# Altium project egitim_proje.PrjPcb (part 1 of 3)
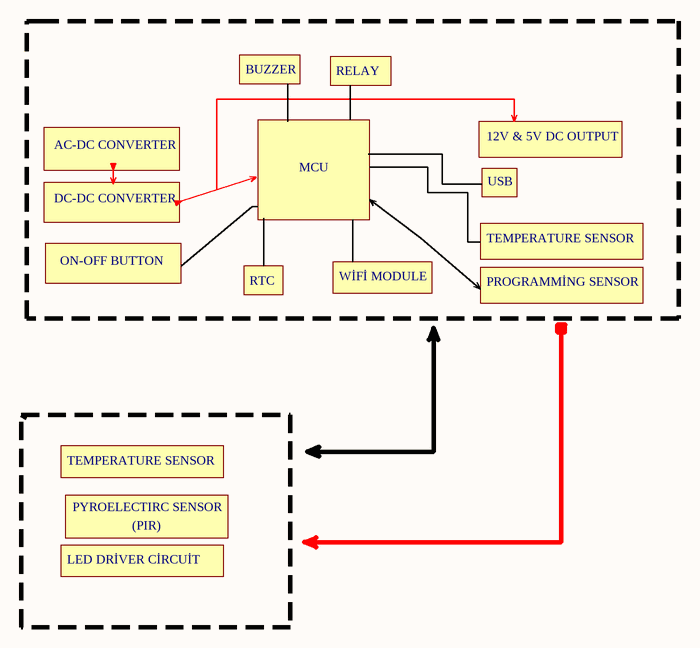
[diagram p0: Block_Diagram.SchDoc]
4 sheets, 127 parts. Net scope: flat (ports and power ports of the same name join across sheets).
Board file: PCB1.PcbDoc
Sheets:
  Block_Diagram.SchDoc
  Power Menegament.SchDoc
  Microocontroller.SchDoc
  Sensor_Board.SchDoc

## Sheet Block_Diagram.SchDoc
size A3; Date: 24.01.2025; DocumentNumber: 2; Revision: a; SheetNumber: 2; SheetTotal: 5; project name: wirelless security dedector; ENG_APP_DATE: --/--/--; DSN_APP_DATE: --/--/--; CHK_APP_DATE: --/--/--

### Notes on the sheet
- BUZZER
- RELAY
- AC-DC CONVERTER
- MCU
- 12V & 5V DC OUTPUT
- USB
- DC-DC CONVERTER
- ON-OFF BUTTON
- TEMPERATURE SENSOR
- RTC
- WİFİ MODULE
- PROGRAMMİNG SENSOR
- PYROELECTIRC SENSOR
- (PIR)
- LED DRİVER CİRCUİT
- DWG. NO.
- REV.
- SHT.
- REVISION
- DESCRIPTION
- DATE
- APPROVED
- THIS DOCUMENT AND THE DATA DISCLOSED HEREIN OR HEREWITH IS THE PROPERTY OF ALTIUM LIMITED AND MAY BE FREELY DISTRIBUTED IN WHOLE. NO RIGHTS ARE RESERVED OR EXPRESS OR IMPLIED WARANTEE GIVEN.
- ENG:
- DSN:
- APPROVALS
- PROJECT
- DOCUMENT REVISION:
- DESIGN ITEM:
- CHK:
- BOM:
- REFERENCE DOCUMENTS
- PROJECT REVISION:
- TITLE
- FAB DWG:
- PCB DWG:
- ASSY DWG:
- SCALE:
- SIZE
- C
- CAGE CODE
- FILE NAME
- DWG NO.
- SHEET
- OF
- REV

## Sheet Power Menegament.SchDoc
size A3; Date: 03.02.2025; CompanyName: Karadeniz Teknik Üniversitesi; Engineer: Kerem D.; SheetNumber: 4; SheetTotal: 6
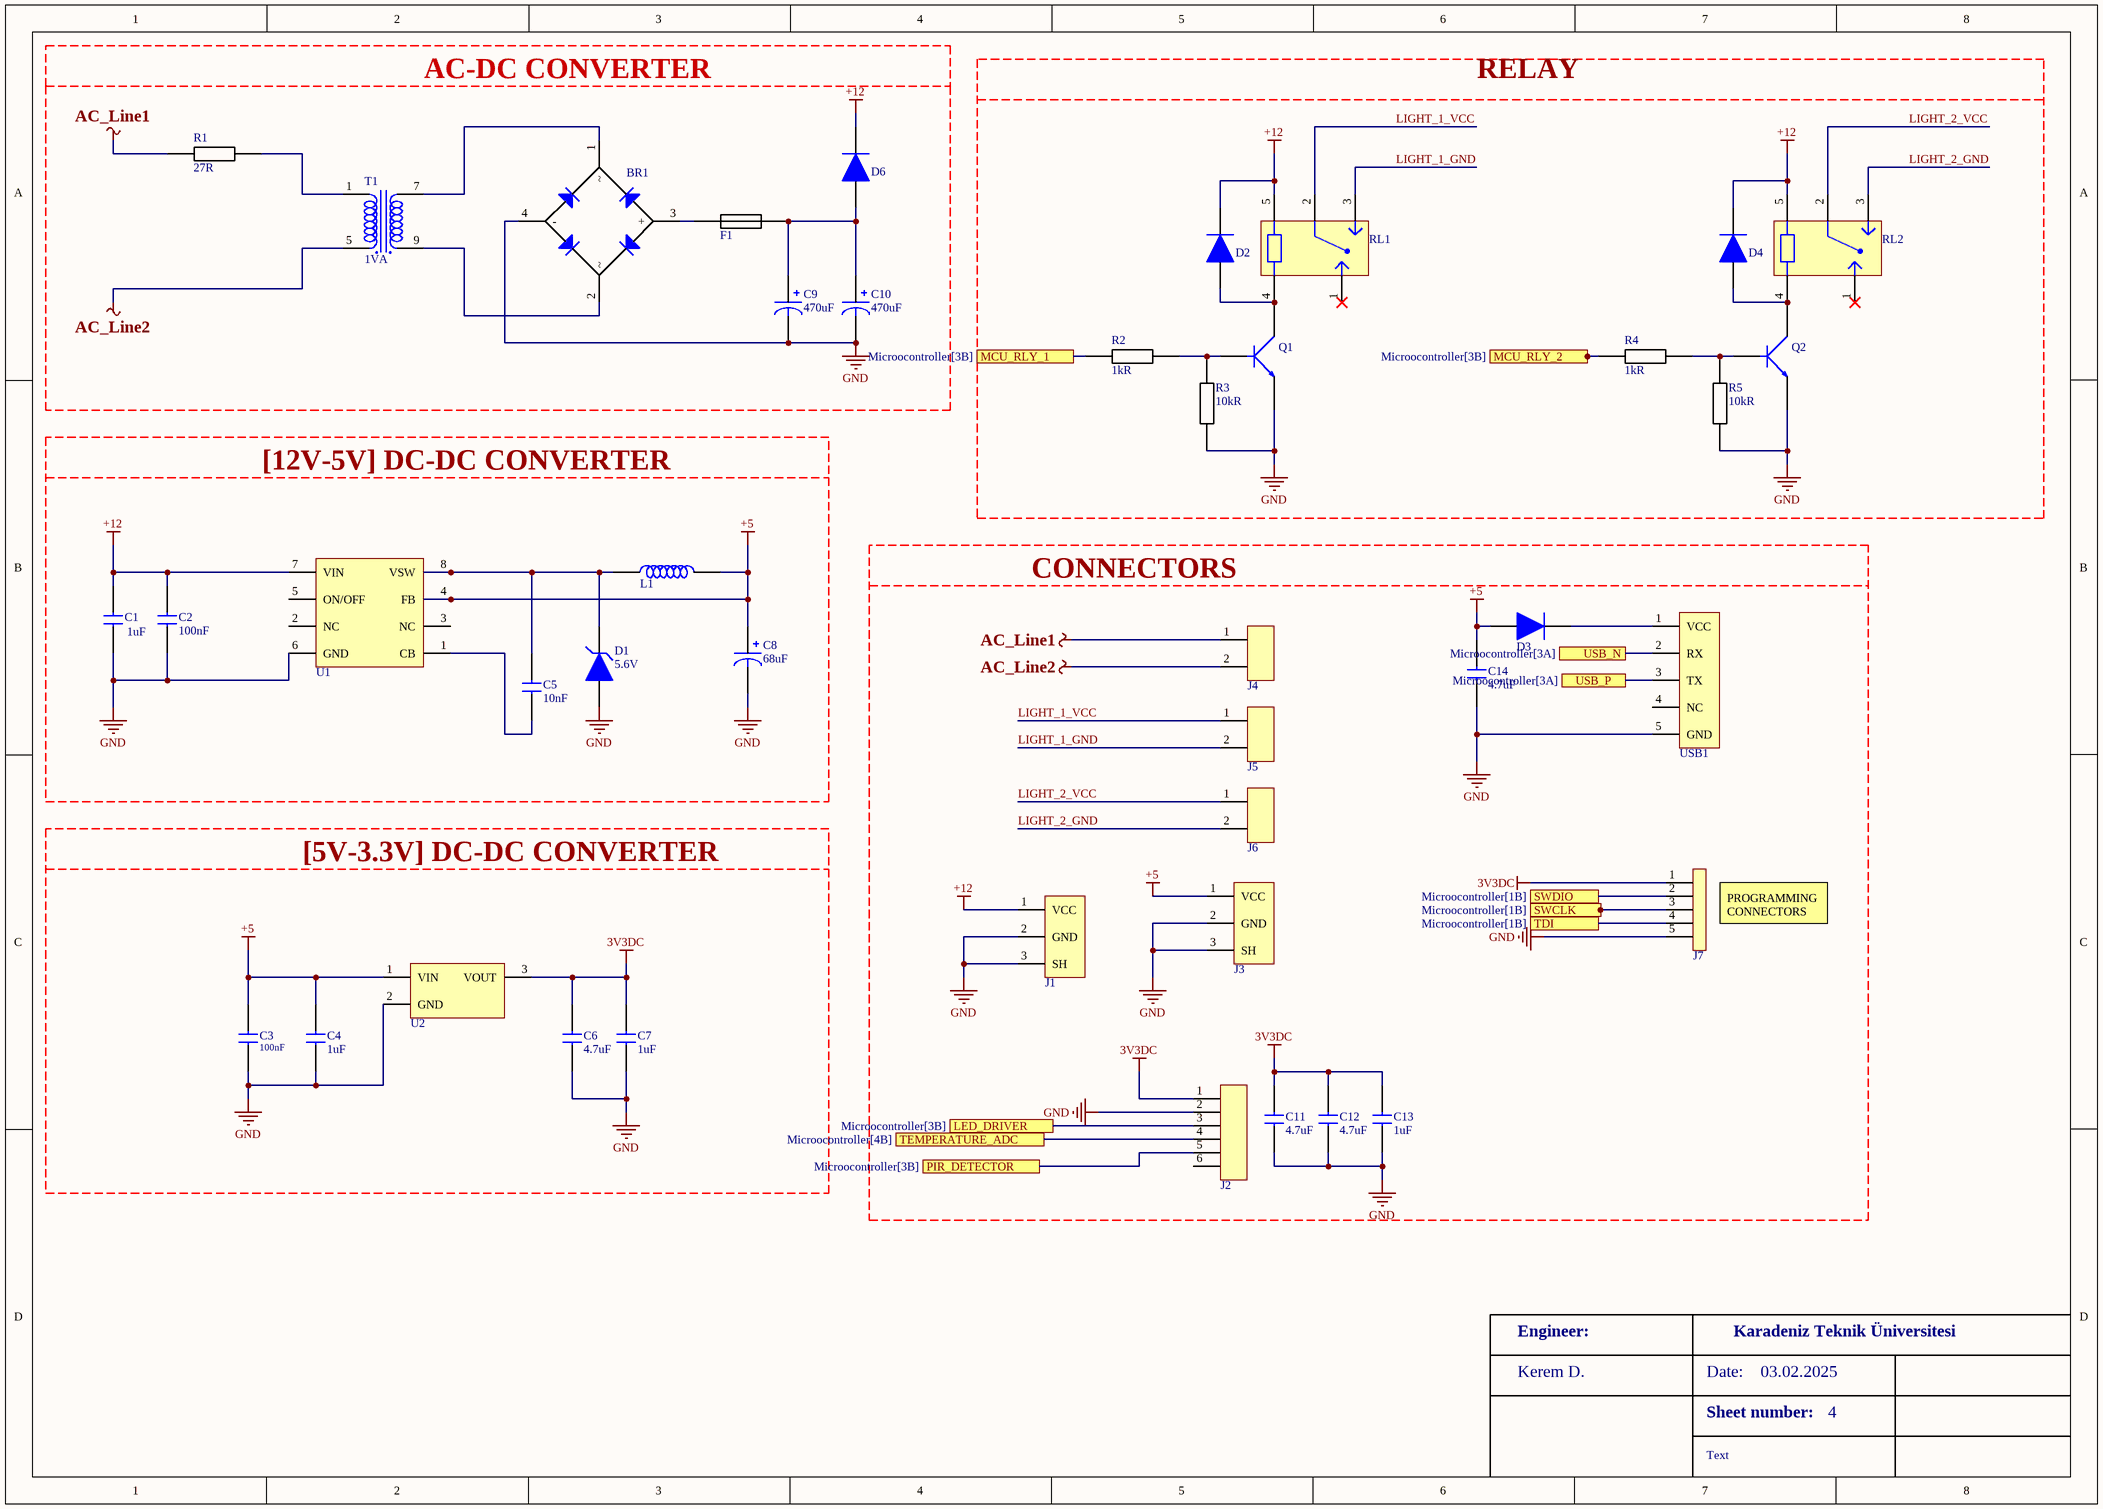
[diagram p1: Power Menegament.SchDoc]

### Parts
BR1  DB105STR  [DB105STR]  (value not drawn)
C1  value 1uF  [CAP_0805]  (hidden comment: CHA08C105K4RXL7189)
C2  value 100nF  [CAP_0805]  (hidden comment: CL21B104KBCNNNC)
C3  value 100nF  [CAP_0603]  (hidden comment: C0603C104M5RACTU)
C4  value 1uF  [CAP_0805]  (hidden comment: CHA08C105K4RXL7189)
C5  value 10nF  [CAP_0603]  (hidden comment: 0603B103K160CT)
C6  value 4.7uF  [CAP_0805]  (hidden comment: CL21A475KAQNNNE)
C7  value 1uF  [CAP_0805]  (hidden comment: CHA08C105K4RXL7189)
C8  value 68uF  [CAP EEVSERİES]  (hidden comment: EEV686M035A9HAA)
C9  value 470uF  [CAP_RADİAL_D10_R5]  (hidden comment: ESH477M035AH4AA)
C10  value 470uF  [CAP_RADİAL_D10_R5]  (hidden comment: ESH477M035AH4AA)
C11  value 4.7uF  [CAP_0805]  (hidden comment: CL21A475KAQNNNE)
C12  value 4.7uF  [CAP_0805]  (hidden comment: CL21A475KAQNNNE)
C13  value 1uF  [CAP_0805]  (hidden comment: CHA08C105K4RXL7189)
C14  value 4.7uF  [CAP_0805]  (hidden comment: CL21A475KAQNNNE)
D1  Reference Voltage-Nom: 5.6V  [SMB]  (hidden comment: 1SMB5919BT3G)
D2  1N4148WS  [SOD323F]  (value not drawn)
D3  1N4148WS  [SOD323F]  (value not drawn)
D4  1N4148WS  [SOD323F]  (value not drawn)
D6  1N4148WS  [SOD323F]  (value not drawn)
F1  3413.0216.22  [FUSE 3413.0216.22]  (value not drawn)
J1  JACK  [JACK]  (value not drawn)
J2  64800611622  [64800611622]  (value not drawn)
J3  JACK  [JACK]  (value not drawn)
J4  JACK  [TBP01R1-508]  (value not drawn)
J5  JACK  [TBP01R1-508]  (value not drawn)
J6  JACK  [TBP01R1-508]  (value not drawn)
J7  SMH-105-02-L-S  [PINHEADER1X5_RA]  (value not drawn)
L1  78438335470  [SMB]  (value not drawn)
Q1  MMBT3904-7-F  [SOT-23F]  (value not drawn)
Q2  MMBT3904-7-F  [SOT-23F]  (value not drawn)
R1  value 27R  [RES_AXIAL_W]  (hidden comment: 5WD27)
R2  value 1kR  [RES_0603]  (hidden comment: RC0603JR-071KL)
R3  value 10kR  [RES_0603]  (hidden comment: RC0603FR-0710KL)
R4  value 1kR  [RES_0603]  (hidden comment: RC0603JR-071KL)
R5  value 10kR  [RES_0603]  (hidden comment: RC0603FR-0710KL)
RL1  ALQ112  [ALQ112]  (value not drawn)
RL2  ALQ112  [ALQ112]  (value not drawn)
T1  Power - Max: 1VA  [BV302S12010-ZU]  (hidden comment: BV302S12010-ZU)
U1  LM2675MX-12/NOPB  [SOIC8]  (value not drawn)
U2  AP7361-33E-13  [SOT223]  (value not drawn)
USB1  10118192-0001LF  [Micro_B_USB]  (value not drawn)

### Blocks framed on the sheet
RELAY: D2 D4 Q1 Q2 R2-R5 RL1 RL2
AC-DC CONVERTER: BR1 C9 C10 D6 F1 R1 T1
[12V-5V] DC-DC CONVERTER: C1 C2 C5 C8 D1 L1 U1
CONNECTORS: C11-C14 D3 J1-J7 USB1
[5V-3.3V] DC-DC CONVERTER: C3 C4 C6 C7 U2

### Ports
LED_DRIVER (see Microocontroller[3B]), MCU_RLY_1 (see Microocontroller[3B]), MCU_RLY_2 (see Microocontroller[3B]), PIR_DETECTOR (see Microocontroller[3B]), SWCLK (see Microocontroller[1B]), SWDIO (see Microocontroller[1B]), TDI (see Microocontroller[1B]), TEMPERATURE_ADC (see Microocontroller[4B]), USB_N (see Microocontroller[3A]), USB_P (see Microocontroller[3A])

### Nets
3V3DC: C6.2 C7.2 C11.2 C12.2 C13.2 J2.1 J7.1 U2.3(VOUT)
+5: C3.2 C4.2 C8.1 C14.2 D3.2 J3.1(VCC) L1.2 U1.4(FB) U2.1(VIN)
+12: C1.2 C2.2 D2.1 D4.1 D6.1 J1.1(VCC) RL1.5 RL2.5 U1.7(VIN)
AC_Line1: J4.1 R1.1
AC_Line2: J4.2 T1.5
GND: BR1.4(-) C1.1 C2.1 C3.1 C4.1 C6.1 C7.1 C8.2 C9.2 C10.2 C11.1 C12.1 C13.1 C14.1 D1.1(A) J1.2(GND) J1.3(SH) J2.2 J3.2(GND) J3.3(SH) J7.5 Q1.2(E) Q2.2(E) R3.1 R5.1 U1.6(GND) U2.2(GND) USB1.5(GND)
LIGHT_1_GND: J5.2 RL1.3
LIGHT_1_VCC: J5.1 RL1.2
LIGHT_2_GND: J6.2 RL2.3
LIGHT_2_VCC: J6.1 RL2.2
USB_N: USB1.2(RX) ; port USB_N
USB_P: USB1.3(TX) ; port USB_P
NetBR1_1: BR1.1 T1.7
NetBR1_2: BR1.2 T1.9
NetBR1_3: BR1.3(+) F1.1
NetC5_1: C5.1 U1.1(CB)
NetC5_2: C5.2 D1.2(C) L1.1 U1.8(VSW)
NetC9_1: C9.1 C10.1 D6.2 F1.2
NetD2_2: D2.2 Q1.3(C) RL1.4
NetD3_1: D3.1 USB1.1(VCC)
NetD4_2: D4.2 Q2.3(C) RL2.4
NetJ2_3: J2.3 ; port LED_DRIVER
NetJ2_4: J2.4 ; port TEMPERATURE_ADC
NetJ2_5: J2.5 ; port PIR_DETECTOR
NetJ7_2: J7.2 ; port SWDIO
NetJ7_3: J7.3 ; port SWCLK
NetJ7_4: J7.4 ; port TDI
NetQ1_1: Q1.1(B) R2.2 R3.2
NetQ2_1: Q2.1(B) R4.2 R5.2
NetR1_2: R1.2 T1.1
NetR2_1: R2.1 ; port MCU_RLY_1
NetR4_1: R4.1 ; port MCU_RLY_2

Not connected (* = marked no-connect by the designer): J2 6; RL1 1(+)*; RL2 1(+)*; U1 2(NC) 3(NC) 5(ON/OFF); USB1 4(NC)

### Notes on the sheet
- (near J7) PROGRAMMING CONNECTORS
- Engineer:
- Date:
- Sheet number:
- Text

### Library data of the parts
BR1 = DB105STR: Bridge Rect 1PHASE 600V 1A Db-s; Manufacturer: Sangdest Microelectronics; Manufacturer Part Number: DB105S; Designed by: Kerem; Supplier: Digikey; Supplier Part Number: 1655-DB105SCT-ND; RoHS: No; Category: Uncategorized; Stock: 8973; Pricing: 1=0,44, 10=0,267, 100=0,1688, 500=0,12602 (USD); ComponentLink1Description: DATASHEET; ComponentLink1URL: https://www.smc-diodes.com/propdf/DB101S%20THRU%20DB107S%20N1459%20REV.B.pdf; Voltage - Peak Reverse (Max): 600V; Current: 1A
C1 C4 C7 C13 = CAP_CER_1uF_0805: Cap CER, 1uF, 16V, 0805;; Manufacturer: KEMET; Designed by: Kerem; Supplier: Digikey; Supplier Part Number: 399-CHA08C105K4RXL7189DKR-ND; Manufacturer Part Number: CHA08C105K4RXL7189; Stock: 600; Pricing: 1=8,82, 10=6,341, 100=4,9085 (USD); ComponentLink1URL: https://datasheet.octopart.com/CHA08C105K4RXL7189-KEMET-datasheet-181963755.pdf?src-supplier=Farnell; ComponentLink1Description: https://datasheet.octopart.com/CHA08C105K4RXL7189-KEMET-datasheet-181963755.pdf?src-supplier=Farnell
C2 = CAP_CER_100nF_0805: Ceramic Capacitor,50V, %10, 0.1uF, Surface Mount, 0805; Manufacturer: Samsung; Multilayer: Yes; Tolerance  (fill in as +-): 10%; Temperature Characteristics Code: X7R; Designed by: Kerem; Supplier: Digikey; Supplier Part Number: 1276-1003-1-ND; Manufacturer Part Number: CL21B104KBCNNNC; RoHS: Yes; Category: Ceramic Capacitors; Stock: 925106; Pricing: 1=0,1, 10=0,029, 100=0,0175, 1000=0,01156 (USD); Mounting Technology: Surface Mount; Pins: 2; Dielectric Material: Ceramic; Package Shape: Rectangular; Case/Package: 0805; Terminal Finish: Nickel; Min Operating Temperature: -55°C; Max Operating Temperature: 125°C; JESD-609 Code: e3; Capacitor Type: Ceramic; Package Style: SMTMeter; Packaging: Tape and Reel; Tolerance (fill in as +-): 10%; Rated DC Voltage (URdc): 50V; Termination: Wraparound; Length: 2mm; Width: 1.25mm; Height: 0.95mm; Reach SVHC Compliant: Yes; RoHS Compliant: Yes; ComponentLink1URL: https://datasheet.ciiva.com:443/pdfs/VipMasterIC/IC/SEMS/SEMS-S-A0008521003/SEMS-S-A0008521039-1.pdf?src-supplier=IHS+Markit; ComponentLink1Description: https://datasheet.ciiva.com:443/pdfs/VipMasterIC/IC/SEMS/SEMS-S-A0008521003/SEMS-S-A0008521039-1.pdf?src-supplier=IHS+Markit; ComponentLink2URL: https://datasheet.ciiva.com/25710/cl21b104kbcnnnc-25710182.pdf?src-supplier=Digikey; ComponentLink2Description: https://datasheet.ciiva.com/25710/cl21b104kbcnnnc-25710182.pdf?src-supplier=Digikey; ComponentLink3URL: https://datasheet.ciiva.com/29199/454152-da-01-en-vs-kondensator-0805-29199814.pdf?src-supplier=Conrad; ComponentLink3Description: https://datasheet.ciiva.com/29199/454152-da-01-en-vs-kondensator-0805-29199814.pdf?src-supplier=Conrad
C3 = CAP CER 100nF 0603: 0.1 µF ±20% 50V Ceramic Capacitor X7R 0603 (1608 Metric); Manufacturer: KEMET; Supplier: Digikey; Supplier Part Number: 399-C0603C104M5RACTUCT-ND; Manufacturer Part Number: C0603C104M5RACTU; RoHS: Yes; Category: Ceramic Capacitors; Stock: 3718959; Pricing: 1=0,1, 10=0,023, 100=0,0133, 1000=0,00866, 4000=0,00697, 8000=0,00632, 12000=0,00598, 20000=0,0056, 28000=0,00538, 40000=0,00516, 100000=0,00467, 200000=0,00436, 400000=0,0041 (USD); ComponentLink1URL: http://capacitoredge.kemet.com:80/capedge2/intellispec.jsp?pn=P2015898&displayPN=P2015898&src-supplier=IHS+Markit; ComponentLink1Description: http://capacitoredge.kemet.com:80/capedge2/intellispec.jsp?pn=P2015898&displayPN=P2015898&src-supplier=IHS+Markit; ComponentLink2URL: http://components.arrow.com/part/dataview/40911037S8853915N7429?src-supplier=Arrow+Electronics; ComponentLink2Description: http://components.arrow.com/part/dataview/40911037S8853915N7429?src-supplier=Arrow+Electronics; ComponentLink3URL: http://www.farnell.com/datasheets/2746056.pdf?src-supplier=Farnell; ComponentLink3Description: http://www.farnell.com/datasheets/2746056.pdf?src-supplier=Farnell; ComponentLink4URL: https://www.verical.com/server-webapp/html/getDatasheet?partID=626892&src-supplier=Verical; ComponentLink4Description: https://www.verical.com/server-webapp/html/getDatasheet?partID=626892&src-supplier=Verical; ComponentLink5URL: http://www.mouser.com/ds/2/212/KEM_C1002_X7R_SMD-1102033.pdf?src-supplier=Mouser; ComponentLink5Description: http://www.mouser.com/ds/2/212/KEM_C1002_X7R_SMD-1102033.pdf?src-supplier=Mouser; ComponentLink6URL: http://www.alliedelec.com/m/d/6f3b5eb83d09db50ed28bdc730567b33.pdf?src-supplier=Allied+Electronics; ComponentLink6Description: http://www.alliedelec.com/m/d/6f3b5eb83d09db50ed28bdc730567b33.pdf?src-supplier=Allied+Electronics; ComponentLink7URL: http://www.farnell.com/datasheets/1828800.pdf?src-supplier=Newark; ComponentLink7Description: http://www.farnell.com/datasheets/1828800.pdf?src-supplier=Newark; ComponentLink8URL: https://datasheet.octopart.com/C0603C104M5RACTU-Kemet-datasheet-5313890.pdf?src-supplier=Verical; ComponentLink8Description: https://datasheet.octopart.com/C0603C104M5RACTU-Kemet-datasheet-5313890.pdf?src-supplier=Verical; ComponentLink9URL: http://capacitoredge.kemet.com/capedge2/DataSheet?pn=C0603C104M5RAC7867&src-supplier=Avnet; ComponentLink9Description: http://capacitoredge.kemet.com/capedge2/DataSheet?pn=C0603C104M5RAC7867&src-supplier=Avnet; ComponentLink10URL: http://www.farnell.com/datasheets/2315113.pdf?src-supplier=Newark; ComponentLink10Description: http://www.farnell.com/datasheets/2315113.pdf?src-supplier=Newark; ComponentLink11URL: https://api.kemet.com/component-edge/download/datasheet/C0603C104M5RACTU.pdf?src-supplier=Digikey; ComponentLink11Description: https://api.kemet.com/component-edge/download/datasheet/C0603C104M5RACTU.pdf?src-supplier=Digikey; ComponentLink12URL: https://datasheet.octopart.com/C0603C104M5RACTU-Kemet-datasheet-65850025.pdf?src-supplier=Element14; ComponentLink12Description: https://datasheet.octopart.com/C0603C104M5RACTU-Kemet-datasheet-65850025.pdf?src-supplier=Element14; ComponentLink13URL: http://www.farnell.com/datasheets/2746056.pdf?src-supplier=Element14; ComponentLink13Description: http://www.farnell.com/datasheets/2746056.pdf?src-supplier=Element14; ComponentLink14URL: http://www.farnell.com/datasheets/2746056.pdf?src-supplier=Newark; ComponentLink14Description: http://www.farnell.com/datasheets/2746056.pdf?src-supplier=Newark; ComponentLink15URL: https://datasheet.octopart.com/C0603C104M5RACTU-KEMET-datasheet-157246124.pdf?src-supplier=Electro+Sonic; ComponentLink15Description: https://datasheet.octopart.com/C0603C104M5RACTU-KEMET-datasheet-157246124.pdf?src-supplier=Electro+Sonic; ComponentLink16URL: https://datasheet.octopart.com/C0603C104M5RACTU-KEMET-datasheet-68331906.pdf?src-supplier=TME; ComponentLink16Description: https://datasheet.octopart.com/C0603C104M5RACTU-KEMET-datasheet-68331906.pdf?src-supplier=TME
C5 = CAP_CER_10nF_0603: Ceramic Capacitor,16V, 10%, 0.01uF, Surface Mount, 0603; Manufacturer: Walsin Technologies; Designed by: Kerem; Multilayer: Yes; Temperature Characteristics Code: X7R; Supplier: Digikey; Supplier Part Number: 1292-1384-6-ND; Manufacturer Part Number: 0603B103K160CT; RoHS: Yes; Category: Ceramic Capacitors; Stock: 40006; Pricing: 1=0,1, 10=0,031, 50=0,018, 100=0,0139, 500=0,0105, 1000=0,00825 (USD); Mounting Technology: Surface Mount; Pins: 2; Dielectric Material: Ceramic; Case/Package: 0603; Package Shape: Rectangular; Terminal Finish: Nickel; Min Operating Temperature: -55°C; Max Operating Temperature: 125°C; Capacitor Type: Ceramic; Tolerance  (fill in as +-): 10%; Package Style: SMTMeter; Packaging: Tape and Reel; Tolerance (fill in as +-): 10%; Rated DC Voltage (URdc): 16V; JESD-609 Code: e3; Termination: Wraparound; Length: 1.6mm; Width: 0.8mm; Height: 0.8mm; Reach SVHC Compliant: Yes; RoHS Compliant: Yes; ComponentLink1URL: https://datasheet.ciiva.com:443/pdfs/VipMasterIC/IC/WATC/WATC-S-A0009550342/WATC-S-A0009550342-1.pdf?src-supplier=IHS+Markit; ComponentLink1Description: https://datasheet.ciiva.com:443/pdfs/VipMasterIC/IC/WATC/WATC-S-A0009550342/WATC-S-A0009550342-1.pdf?src-supplier=IHS+Markit; ComponentLink2URL: http://www.farnell.com/datasheets/1958513.pdf?src-supplier=Farnell; ComponentLink2Description: http://www.farnell.com/datasheets/1958513.pdf?src-supplier=Farnell; ComponentLink3URL: https://datasheet.octopart.com/0603B103K160CT-Walsin-Technologies-datasheet-85392065.pdf?src-supplier=Element14; ComponentLink3Description: https://datasheet.octopart.com/0603B103K160CT-Walsin-Technologies-datasheet-85392065.pdf?src-supplier=Element14; ComponentLink4URL: http://www.passivecomponent.com/wp-content/uploads/2018/10/MLCC.pdf?src-supplier=Digikey; ComponentLink4Description: http://www.passivecomponent.com/wp-content/uploads/2018/10/MLCC.pdf?src-supplier=Digikey; ComponentLink5URL: https://datasheet.octopart.com/0603B103K160CT-Walsin-Technologies-datasheet-136037192.pdf?src-supplier=Future+Electronics; ComponentLink5Description: https://datasheet.octopart.com/0603B103K160CT-Walsin-Technologies-datasheet-136037192.pdf?src-supplier=Future+Electronics; ComponentLink6URL: https://datasheet.octopart.com/0603B103K160CT-Walsin-Technologies-datasheet-62066062.pdf?src-supplier=TME; ComponentLink6Description: https://datasheet.octopart.com/0603B103K160CT-Walsin-Technologies-datasheet-62066062.pdf?src-supplier=TME
C6 C11 C12 C14 = CAP_CER_4.7uF_0805: CAP CER 4.7uF,%10, Surface Mount, 0805; Manufacturer: Samsung; Designed by: Kerem; Dielectric Material: Ceramic; Multilayer: Yes; Tolerance  (fill in as +-): 10%; Rated DC Voltage (URdc): 25V; Temperature Characteristics Code: X5R; Supplier: Digikey; Supplier Part Number: 1276-1244-1-ND; Manufacturer Part Number: CL21A475KAQNNNE; RoHS: Yes; Category: Ceramic Capacitors; Stock: 2727040; Pricing: 1=0,1, 10=0,048, 100=0,03, 1000=0,02035 (USD); Mounting Technology: Surface Mount; Pins: 2; Package Shape: Rectangular; Case/Package: 0805; Terminal Finish: Nickel; Min Operating Temperature: -55°C; Max Operating Temperature: 85°C; JESD-609 Code: e3; Capacitor Type: Ceramic; Package Style: SMTMeter; Packaging: Tape and Reel; Tolerance (fill in as +-): 10%; Termination: Wraparound; Length: 2mm; Width: 1.25mm; Height: 1.4mm; Reach SVHC Compliant: Yes; RoHS Compliant: Yes; ComponentLink1URL: https://datasheet.ciiva.com:443/pdfs/VipMasterIC/IC/SEMS/SEMS-S-A0008528919/SEMS-S-A0008528938-1.pdf?src-supplier=IHS+Markit; ComponentLink1Description: https://datasheet.ciiva.com:443/pdfs/VipMasterIC/IC/SEMS/SEMS-S-A0008528919/SEMS-S-A0008528938-1.pdf?src-supplier=IHS+Markit; ComponentLink2URL: https://datasheet.ciiva.com/25798/cl21a475kaqnnne-25798882.pdf?src-supplier=Digikey; ComponentLink2Description: https://datasheet.ciiva.com/25798/cl21a475kaqnnne-25798882.pdf?src-supplier=Digikey
C8 = CAP_ALU_68uF: Aluminum Electrolytic Capacitor, 35V, 20%, 68uF, Surface Mount, 2626; Manufacturer: KEMET; Designed by: Kerem; Dielectric Material: Aluminium; Polarity: Polarized; ESR (Equivalent Series Resistance): 340mR; Leakage Current: 23.8uA; Ripple Current: 196mA; Tan Delta: 0.12; Supplier: Digikey; Supplier Part Number: 399-6722-6-ND; Manufacturer Part Number: EEV686M035A9HAA; RoHS: Yes; Category: Aluminum Electrolytic Capacitors; Stock: 22607; Pricing: 1=0,57, 10=0,357, 50=0,2728, 100=0,2457, 500=0,19804 (USD); Mounting Technology: Surface Mount; Pins: 2; Package Shape: Cylindrical; Case/Package: 2626; Min Operating Temperature: -55°C; Max Operating Temperature: 105°C; Capacitor Type: Aluminium; Tolerance  (fill in as +-): 20%; Package Style: SMTMeter; Packaging: Tape and Reel; Tolerance (fill in as +-): 20%; Rated DC Voltage (URdc): 35V; Termination: Flat; Length: 7.8mm; Width: 6.6mm; Height: 7.7mm; Reach SVHC Compliant: Yes; RoHS Compliant: Yes; ComponentLink1URL: https://datasheet.ciiva.com:443/pdfs/VipMasterIC/IC/KEME/KEME-S-A0008611149/KEME-S-A0008611149-1.pdf?src-supplier=IHS+Markit; ComponentLink1Description: https://datasheet.ciiva.com:443/pdfs/VipMasterIC/IC/KEME/KEME-S-A0008611149/KEME-S-A0008611149-1.pdf?src-supplier=IHS+Markit; ComponentLink2URL: https://datasheet.ciiva.com/5365/kem-a4002-eev-535332-5365784.pdf?src-supplier=Mouser; ComponentLink2Description: https://datasheet.ciiva.com/5365/kem-a4002-eev-535332-5365784.pdf?src-supplier=Mouser
C9 C10 = CAP_ALU_470uF: Aluminum Electrolytic Capacitor, Polarized, Aluminum (wet), 35V, 20% +Tol, 20% -Tol, 470uF, Through Hole Mount; Manufacturer: KEMET; Dielectric Material: Aluminium; Leakage Current: 167uA; Ripple Current: 580mA; Tan Delta: 0.14; Designed by: Kerem; Supplier: Digikey; Supplier Part Number: 399-ESH477M035AH4AA-ND; Manufacturer Part Number: ESH477M035AH4AA; RoHS: Yes; Category: Aluminum Electrolytic Capacitors; Pricing: 2400=0,16564 (USD); Mounting Technology: Through Hole; Pins: 2; Package Shape: Cylindrical; Min Operating Temperature: -40°C; Max Operating Temperature: 105°C; Polarity: Polarized; Capacitor Type: Aluminium; Tolerance  (fill in as +-): 20%; Package Style: RadialMeter; Packaging: Bulk; Tolerance (fill in as +-): 20%; Rated DC Voltage (URdc): 35V; Termination: Wire; Diameter: 10mm; Length: 19mm; Terminal Pitch: 5mm; Reach SVHC Compliant: Yes; RoHS Compliant: Yes; ComponentLink1URL: https://datasheet.ciiva.com:443/pdfs/VipMasterIC/IC/KEME/KEME-S-A0008512286/KEME-S-A0008512286-1.pdf?src-supplier=IHS+Markit; ComponentLink1Description: https://datasheet.ciiva.com:443/pdfs/VipMasterIC/IC/KEME/KEME-S-A0008512286/KEME-S-A0008512286-1.pdf?src-supplier=IHS+Markit; ComponentLink2URL: https://datasheet.ciiva.com/22627/1794402-22627147.pdf?src-supplier=Farnell; ComponentLink2Description: https://datasheet.ciiva.com/22627/1794402-22627147.pdf?src-supplier=Farnell
D1 = 1SMB5919BT3G: Zener Diode, 5.6V V(Z), 5%, 0.55W, Silicon, Unidirectional, DO-214AA; Manufacturer: ON Semiconductor; Designed by: Kerem; Package Body Material: Plastic; Number of Elements: 1; Max Power Dissipation: 550mW; Dynamic Impedance-Max: 2R; Test Current: 66.9mA; Time @ Peak Reflow Temperature-Max (s): 40s; Qualification Status: Not Qualified; Supplier: Digikey; Supplier Part Number: 1SMB5919BT3GOSCT-ND; Manufacturer Part Number: 1SMB5919BT3G; RoHS: Yes; Category: Zener Diodes; Stock: 7351; Pricing: 1=0,36, 10=0,239, 100=0,119, 500=0,116, 1000=0,113, 2500=0,077, 5000=0,0755, 7500=0,0735 (USD); Pins: 2; Diode Element Material: SILICON; Package Shape: Rectangular; Terminal Finish: Tin; Min Operating Temperature: -65°C; Max Operating Temperature: 150°C; JESD-609 Code: e3; Diode Type: ZENER; Moisture Sensitivity Level: 1; Package Style: SMALL OUTLINEMeter; Surface Mount: Yes; Terminal Form: L BEND; Terminal Position: DUAL; Polarity: Unidirectional; Technology: ZENER; Voltage Tol-Max: 5%; Peak Reflow Temperature (Cel): 260°C; RoHS Compliant: Yes; Reach SVHC Compliant: No; JEDEC-95 Code: DO-214AA; ComponentLink1URL: https://datasheet.ciiva.com:443/pdfs/VipMasterIC/IC/ONSM/ONSM-S-A0001810303/ONSM-S-A0001810303-1.pdf?src-supplier=IHS+Markit; ComponentLink1Description: https://datasheet.ciiva.com:443/pdfs/VipMasterIC/IC/ONSM/ONSM-S-A0001810303/ONSM-S-A0001810303-1.pdf?src-supplier=IHS+Markit; ComponentLink2URL: https://datasheet.ciiva.com/27747/1308331-27747654.pdf?src-supplier=Jameco; ComponentLink2Description: https://datasheet.ciiva.com/27747/1308331-27747654.pdf?src-supplier=Jameco; ComponentLink3URL: https://datasheet.ciiva.com/895/1smb5913bt3-d-895203.pdf?src-supplier=Digikey; ComponentLink3Description: https://datasheet.ciiva.com/895/1smb5913bt3-d-895203.pdf?src-supplier=Digikey; ComponentLink4URL: https://datasheet.ciiva.com/895/1smb5913bt3-d-895204.pdf?src-supplier=Digikey; ComponentLink4Description: https://datasheet.ciiva.com/895/1smb5913bt3-d-895204.pdf?src-supplier=Digikey; ComponentLink5URL: https://datasheet.ciiva.com/895/1smb5913bt3-d-895205.pdf?src-supplier=Digikey; ComponentLink5Description: https://datasheet.ciiva.com/895/1smb5913bt3-d-895205.pdf?src-supplier=Digikey; ComponentLink6URL: https://datasheet.ciiva.com/1182/1smb5913bt3-d-1182657.pdf?src-supplier=Element14; ComponentLink6Description: https://datasheet.ciiva.com/1182/1smb5913bt3-d-1182657.pdf?src-supplier=Element14; ComponentLink7URL: https://datasheet.ciiva.com/1182/1smb5913bt3-d-1182658.pdf?src-supplier=Element14; ComponentLink7Description: https://datasheet.ciiva.com/1182/1smb5913bt3-d-1182658.pdf?src-supplier=Element14; ComponentLink8URL: https://datasheet.ciiva.com/16311/1smb5913bt3-d-16311847.pdf?src-supplier=Future+Electronics; ComponentLink8Description: https://datasheet.ciiva.com/16311/1smb5913bt3-d-16311847.pdf?src-supplier=Future+Electronics; ComponentLink9URL: https://datasheet.ciiva.com/15198/getdatasheetpartid-311040-15198695.pdf?src-supplier=Verical; ComponentLink9Description: https://datasheet.ciiva.com/15198/getdatasheetpartid-311040-15198695.pdf?src-supplier=Verical
D2-D4 D6 = 1N4148WS: Rectifier Diode, 1 Phase, 1 Element, 0.15A, 100V V(RRM), Silicon; Manufacturer: ON Semiconductor / Fairchild; Package Body Material: Plastic; Number of Elements: 1; Max Output current: 150mA; Reverse Recovery Time-Max: 0.004us; Forward Voltage: 1V; Qualification Status: Not Qualified; Designed by: Kerem; Supplier: Digikey; Supplier Part Number: 1N4148WSFSCT-ND; Manufacturer Part Number: 1N4148WS; RoHS: Yes; Category: Rectifier Diodes; Stock: 336004; Pricing: 1=0,11, 10=0,066, 100=0,0485, 500=0,03852, 1000=0,03522 (USD); Pins: 2; Diode Element Material: SILICON; Package Shape: Rectangular; Max Operating Temperature: 150°C; Diode Type: RECTIFIER; JESD-30 Code: R-PDSO-F2; Package Style: SMALL OUTLINEMeter; Rep Pk Reverse Voltage-Max: 100V; Surface Mount: Yes; Terminal Form: Flat; Terminal Position: DUAL; Moisture Sensitivity Level: 1; Reach SVHC Compliant: Yes; RoHS Compliant: Yes; ComponentLink1URL: https://datasheet.ciiva.com:443/pdfs/VipMasterIC/IC/ONSM/ONSM-S-A0003392874/ONSM-S-A0003585195-1.pdf?src-supplier=IHS+Markit; ComponentLink1Description: https://datasheet.ciiva.com:443/pdfs/VipMasterIC/IC/ONSM/ONSM-S-A0003392874/ONSM-S-A0003585195-1.pdf?src-supplier=IHS+Markit; ComponentLink2URL: https://datasheet.ciiva.com/15208/getdatasheetpartid-127819-15208358.pdf?src-supplier=Verical; ComponentLink2Description: https://datasheet.ciiva.com/15208/getdatasheetpartid-127819-15208358.pdf?src-supplier=Verical; ComponentLink3URL: https://datasheet.ciiva.com/8300/1n914bws-8300360.pdf?src-supplier=Avnet; ComponentLink3Description: https://datasheet.ciiva.com/8300/1n914bws-8300360.pdf?src-supplier=Avnet; ComponentLink4URL: https://datasheet.ciiva.com/910/1n4148ws-910381.pdf?src-supplier=Digikey; ComponentLink4Description: https://datasheet.ciiva.com/910/1n4148ws-910381.pdf?src-supplier=Digikey; ComponentLink5URL: https://datasheet.ciiva.com/910/1n4148ws-910382.pdf?src-supplier=Digikey; ComponentLink5Description: https://datasheet.ciiva.com/910/1n4148ws-910382.pdf?src-supplier=Digikey; ComponentLink6URL: https://datasheet.ciiva.com/910/1n4148ws-910380.pdf?src-supplier=Digikey; ComponentLink6Description: https://datasheet.ciiva.com/910/1n4148ws-910380.pdf?src-supplier=Digikey
F1 = FUSE 3413.0216.22: Electric Fuse, Very Fast Blow, 1A, 32VAC, 63VDC, 63A (IR), Surface Mount, 1206; Manufacturer: Schurter; Joule-integral-Nom: 0.2J; Pre-arcing time-Min: 1ms; Voltage Rating: 32V; Body Breadth: 1.6mm; Body Height: 0.6mm; Body Length or Diameter: 3.2mm; Reference Standard: UL; Designed by: Kerem; Supplier: Digikey; Supplier Part Number: 486-1144-1-ND; Manufacturer Part Number: 3413.0216.22; RoHS: Yes; Category: Fuses; Stock: 13656; Pricing: 1=0,67, 50=0,524, 100=0,397, 500=0,3625 (USD); Mounting Technology: Surface Mount; Terminal Finish: Nickel; Min Operating Temperature: -55°C; Max Operating Temperature: 90°C; JESD-609 Code: e4; Blow Characteristic: VERY FAST; Circuit Protection Type: Electric Fuse; Packaging: Tape and Reel; Rated Breaking Capacity: 63A; Current Rating: 1A; Termination: Wraparound; Reach SVHC Compliant: Yes; RoHS Compliant: Yes; ComponentLink1URL: https://datasheet.ciiva.com:443/pdfs/VipMasterIC/IC/SHRI/SHRI-S-A0004985783/SHRI-S-A0004985783-1.pdf?src-supplier=IHS+Markit; ComponentLink1Description: https://datasheet.ciiva.com:443/pdfs/VipMasterIC/IC/SHRI/SHRI-S-A0004985783/SHRI-S-A0004985783-1.pdf?src-supplier=IHS+Markit; ComponentLink2URL: https://datasheet.ciiva.com/301/typ-usi-1206-301440.pdf?src-supplier=Digikey; ComponentLink2Description: https://datasheet.ciiva.com/301/typ-usi-1206-301440.pdf?src-supplier=Digikey; ComponentLink3URL: https://datasheet.ciiva.com/14102/qousi1206-data-e-14102903.pdf?src-supplier=Distrelec; ComponentLink3Description: https://datasheet.ciiva.com/14102/qousi1206-data-e-14102903.pdf?src-supplier=Distrelec; ComponentLink4URL: https://datasheet.ciiva.com/8264/typ-usi-1206-8264583.pdf?src-supplier=Avnet; ComponentLink4Description: https://datasheet.ciiva.com/8264/typ-usi-1206-8264583.pdf?src-supplier=Avnet; ComponentLink5URL: https://datasheet.ciiva.com/16316/typ-usi-1206-16316588.pdf?src-supplier=Future+Electronics; ComponentLink5Description: https://datasheet.ciiva.com/16316/typ-usi-1206-16316588.pdf?src-supplier=Future+Electronics; ComponentLink6URL: https://datasheet.ciiva.com/301/typ-usi-1206-301439.pdf?src-supplier=Digikey; ComponentLink6Description: https://datasheet.ciiva.com/301/typ-usi-1206-301439.pdf?src-supplier=Digikey; ComponentLink7URL: https://datasheet.ciiva.com/301/typ-usi-1206-301441.pdf?src-supplier=Digikey; ComponentLink7Description: https://datasheet.ciiva.com/301/typ-usi-1206-301441.pdf?src-supplier=Digikey; ComponentLink8URL: https://datasheet.ciiva.com/14541/70160006-14541114.pdf?src-supplier=Allied+Electronics; ComponentLink8Description: https://datasheet.ciiva.com/14541/70160006-14541114.pdf?src-supplier=Allied+Electronics
J1 J3 = PJ-037AH-SMT-TR: DC Power Plug or Jack; Manufacturer: CUI; Designed by: Kerem; Supplier: Digikey; Supplier Part Number: CP-037AHPJTR-ND; Manufacturer Part Number: PJ-037AH-SMT-TR; RoHS: Yes; Category: Uncategorized; ComponentLink1URL: https://datasheet.ciiva.com:443/pdfs/VipMasterIC/IC/CUIS/CUIS-S-A0007082150/CUIS-S-A0007083261-1.pdf?src-supplier=IHS+Markit; ComponentLink1Description: https://datasheet.ciiva.com:443/pdfs/VipMasterIC/IC/CUIS/CUIS-S-A0007082150/CUIS-S-A0007083261-1.pdf?src-supplier=IHS+Markit; ComponentLink2URL: http://www.mouser.com/ds/2/670/pj-037ah-smt-516065.pdf?src-supplier=Mouser; ComponentLink2Description: http://www.mouser.com/ds/2/670/pj-037ah-smt-516065.pdf?src-supplier=Mouser; ComponentLink3URL: https://www.cui.com/product/resource/digikeypdf/pj-037ah-smt-tr.pdf?src-supplier=Digikey; ComponentLink3Description: https://www.cui.com/product/resource/digikeypdf/pj-037ah-smt-tr.pdf?src-supplier=Digikey; ComponentLink4URL: http://www.cui.com/product/resource/digikeypdf/pj-037ah-smt.pdf?src-supplier=Digikey; ComponentLink4Description: http://www.cui.com/product/resource/digikeypdf/pj-037ah-smt.pdf?src-supplier=Digikey
J2 = 64800611622_CONN_6PINS: WR-WTB Wire-to-Board Connectors 1.50 mm; Manufacturer: Wurth Electronics; Designed by: Kerem; Supplier: Digikey; Supplier Part Number: 732-64800611622-ND; Manufacturer Part Number: 64800611622; RoHS: No; Category: Uncategorized; Stock: 1237; Pricing: 1=0,38, 50=0,3654, 100=0,3456, 250=0,32492, 500=0,3051 (USD)
J4-J6 = TBP01R1-508-02BE: Strip Terminal Block 2 Pins; Manufacturer: CUI Devices; Designed by: Kerem; Supplier: Digikey; Supplier Part Number: 102-6406-ND; Manufacturer Part Number: TBP01R1-508-02BE; RoHS: Yes; Category: Terminal Blocks; Stock: 90039; Pricing: 1=0,47, 10=0,218, 25=0,1684, 50=0,1412, 100=0,121, 400=0,09438, 800=0,08583, 1200=0,08184, 5200=0,0775 (USD); ComponentLink1URL: https://www.cuidevices.com/product/resource/digikeypdf/tbp01r1-508.pdf?src-supplier=Digikey; ComponentLink1Description: https://www.cuidevices.com/product/resource/digikeypdf/tbp01r1-508.pdf?src-supplier=Digikey; ComponentLink2URL: https://datasheet.octopart.com/TBP01R1-508-02BE-CUI-Devices-datasheet-147843976.pdf?src-supplier=Future+Electronics; ComponentLink2Description: https://datasheet.octopart.com/TBP01R1-508-02BE-CUI-Devices-datasheet-147843976.pdf?src-supplier=Future+Electronics; ComponentLink3URL: https://datasheet.octopart.com/TBP01R1-508-02BE-CUI-Devices-datasheet-154730754.pdf?src-supplier=Electro+Sonic; ComponentLink3Description: https://datasheet.octopart.com/TBP01R1-508-02BE-CUI-Devices-datasheet-154730754.pdf?src-supplier=Electro+Sonic
J7 = SMH-105-02-L-S: Board Connector, 5 Contact(s), Socket; Manufacturer: Samtec; Designed by: Kerem; Contact Pattern: RECTANGULAR; Contact Style: SQ PIN-SKT; Number Of Connectors: 1; Polarization Key: POLARIZED HOUSING; Number of Contacts: 5; Option: General Purpose; Filter Feature: No; Mating Information: MULTIPLE MATING PARTS AVAILABLE; Body Breadth: 0.095inch; Body Depth: 0.47inch; Body Length: 0.52inch; Mating Contact Pitch: 0.1inch; Mounting Option 1: LOCKING; Plating Thickness: 10uin; Reference Standard: UL; Reliability: COMMERCIAL; Supplier: Digikey; Supplier Part Number: SAM11813-ND; Manufacturer Part Number: SMH-105-02-L-S; RoHS: Yes; Category: Connectors; Stock: 168; Pricing: 1=2,01, 50=1,56, 100=1,26, 500=1,07, 1000=1 (USD); Mounting Technology: Board; Contact Material: Bronze; Contact Finish - Termination: Tin (Sn) - with Nickel (Ni) barrier; Contact Finish - Mating: GOLD (10) OVER NICKEL (50); Insulation Color: Black; Insulation Material: Polymer; Connector Type: BOARD CONNECTOR; JESD-609 Code: e3; Contact Gender: Female; Mounting Style: RIGHT ANGLE; Number Of PCB Rows: 1; Number of Rows Loaded: 1; PCB Contact Pattern: RECTANGULAR; Termination: SMD/SMT; Body/Shell Style: SOCKET; Mixed Contacts: No; Terminal Pitch: 2.54mm; Reach SVHC Compliant: Yes; RoHS Compliant: Yes; DIN Conformance: No; IEC Conformance: No; MIL Conformance: No; ComponentLink1URL: https://datasheet.ciiva.com:443/pdfs/VipMasterIC/IC/SAMI/SAMI-S-A0002821944/SAMI-S-A0002821944-1.pdf?src-supplier=IHS+Markit; ComponentLink1Description: https://datasheet.ciiva.com:443/pdfs/VipMasterIC/IC/SAMI/SAMI-S-A0002821944/SAMI-S-A0002821944-1.pdf?src-supplier=IHS+Markit; ComponentLink2URL: http://www.farnell.com/datasheets/1927708.pdf?_ga=2.237598468.569325269.1503285096-1413671594.1503025027&src-supplier=Farnell; ComponentLink2Description: http://www.farnell.com/datasheets/1927708.pdf?_ga=2.237598468.569325269.1503285096-1413671594.1503025027&src-supplier=Farnell; ComponentLink3URL: http://www.samtec.com/documents/webfiles/pdf/SMH.PDF?src-supplier=Newark; ComponentLink3Description: http://www.samtec.com/documents/webfiles/pdf/SMH.PDF?src-supplier=Newark; ComponentLink4URL: http://www.samtec.com/documents/webfiles/pdf/SMH.PDF?src-supplier=Avnet; ComponentLink4Description: http://www.samtec.com/documents/webfiles/pdf/SMH.PDF?src-supplier=Avnet; ComponentLink5URL: http://suddendocs.samtec.com/catalog_english/smh.pdf?src-supplier=Digikey; ComponentLink5Description: http://suddendocs.samtec.com/catalog_english/smh.pdf?src-supplier=Digikey
L1 = IND_47uH: General Purpose Inductor, 47uH, 20%, 1 Element, Iron Alloy-Core, SMD, 1212; Manufacturer: Wurth Electronics; Designed by: Kerem; Supplier: Digikey; Supplier Part Number: 732-6947-1-ND; Manufacturer Part Number: 78438335470; RoHS: Yes; Category: Fixed Inductors; Stock: 5407; Pricing: 1=1,9, 50=1,773, 250=1,62272, 500=1,5048 (USD); Inductor Type: GENERAL PURPOSE INDUCTOR; Reach SVHC Compliant: Yes; RoHS Compliant: No; ComponentLink1URL: https://datasheet.ciiva.com:443/pdfs/VipMasterIC/IC/MIDC/MIDC-S-A0004708317/MIDC-S-A0004708317-1.pdf?src-supplier=IHS+Markit; ComponentLink1Description: https://datasheet.ciiva.com:443/pdfs/VipMasterIC/IC/MIDC/MIDC-S-A0004708317/MIDC-S-A0004708317-1.pdf?src-supplier=IHS+Markit; ComponentLink2URL: https://media.digikey.com/pdf/Data%20Sheets/Wurth%20Electronics%20PDFs/Q+_Products_Flyer.pdf?src-supplier=Digikey; ComponentLink2Description: https://media.digikey.com/pdf/Data%20Sheets/Wurth%20Electronics%20PDFs/Q+_Products_Flyer.pdf?src-supplier=Digikey
Q1 Q2 = MMBT3904-7-F: Small Signal Bipolar Transistor, 0.2A I(C), 40V V(BR)CEO, 1-Element, NPN, Silicon; Manufacturer: Diodes Zetex; Designed by: Kerem; Package Body Material: Plastic; Additional Feature: HIGH RELIABILITY; Max Collector Current: 200mA; DC Current Gain-Min (hFE): 30; Number of Elements: 1; Power Dissipation-Max (Abs): 300mW; Time @ Peak Reflow Temperature-Max (s): 40s; Transistor Application: SWITCHING; Frequency: 300MHz; Turn-off Time-Max (toff): 250ns; Turn-on Time-Max (ton): 70ns; Qualification Status: Not Qualified; Supplier: Digikey; Supplier Part Number: MMBT3904-FDICT-ND; Manufacturer Part Number: MMBT3904-7-F; RoHS: Yes; Category: BJTs; Stock: 3621103; Pricing: 1=0,12, 10=0,075, 100=0,0458, 500=0,03304, 1000=0,02888 (USD); Pins: 3; Package Shape: Rectangular; Terminal Finish: Tin; Transistor Element Material: SILICON; Max Operating Temperature: 150°C; JESD-609 Code: e3; Polarity/Channel Type: NPN; Collector-emitter Voltage-Max: 40V; JESD-30 Code: R-PDSO-G3; Moisture Sensitivity Level: 1; Package Style: SMALL OUTLINEMeter; Peak Reflow Temperature (Cel): 260°C; Surface Mount: Yes; Terminal Form: Gull Wing; Terminal Position: DUAL; Reach SVHC Compliant: Yes; RoHS Compliant: Yes; ComponentLink1URL: https://datasheet.ciiva.com:443/pdfs/VipMasterIC/IC/DIOD/DIOD-S-A0003133141/DIOD-S-A0003133141-1.pdf?src-supplier=IHS+Markit; ComponentLink1Description: https://datasheet.ciiva.com:443/pdfs/VipMasterIC/IC/DIOD/DIOD-S-A0003133141/DIOD-S-A0003133141-1.pdf?src-supplier=IHS+Markit; ComponentLink2URL: https://datasheet.ciiva.com/11201/ds30036-11201778.pdf?src-supplier=Avnet; ComponentLink2Description: https://datasheet.ciiva.com/11201/ds30036-11201778.pdf?src-supplier=Avnet; ComponentLink3URL: https://datasheet.ciiva.com/15138/getdatasheetpartid-53265-15138780.pdf?src-supplier=Verical; ComponentLink3Description: https://datasheet.ciiva.com/15138/getdatasheetpartid-53265-15138780.pdf?src-supplier=Verical; ComponentLink4URL: https://datasheet.ciiva.com/22711/1915516-22711750.pdf?src-supplier=Element14; ComponentLink4Description: https://datasheet.ciiva.com/22711/1915516-22711750.pdf?src-supplier=Element14; ComponentLink5URL: https://datasheet.ciiva.com/11198/ds30036-11198999.pdf?src-supplier=Avnet; ComponentLink5Description: https://datasheet.ciiva.com/11198/ds30036-11198999.pdf?src-supplier=Avnet; ComponentLink6URL: https://datasheet.ciiva.com/6361/ds30036-6361256.pdf?src-supplier=Digikey; ComponentLink6Description: https://datasheet.ciiva.com/6361/ds30036-6361256.pdf?src-supplier=Digikey; ComponentLink7URL: https://datasheet.ciiva.com/6361/ds30036-6361254.pdf?src-supplier=Digikey; ComponentLink7Description: https://datasheet.ciiva.com/6361/ds30036-6361254.pdf?src-supplier=Digikey
R1 = 5WD27: 5W, 27ohm, 350V, 5% Through Hole Mount, 8739; Manufacturer: TE Connectivity CGS; Manufacturer Part Number: SQPW527RJ; Designed by: Kerem; Temperature Coefficient (ppm/Cel): 300; Lead Diameter: 0.8mm; Lead Length: 35mm; Package Height: 9mm; Package Length: 22mm; Package Width: 10mm; Supplier: Digikey; Supplier Part Number: A137438-ND; RoHS: Yes; Category: Through-Hole Resistors; Stock: 1394; Pricing: 1=0,82, 10=0,469, 25=0,38, 50=0,3258, 100=0,2806, 320=0,22103, 640=0,19313, 1280=0,16976, 5120=0,14128 (USD); Mounting Technology: Through Hole; Pins: 2; Package Shape: Rectangular; Case/Package: 8739; Min Operating Temperature: -55°C; Max Operating Temperature: 155°C; Tolerance: 5%; Resistor Type: FIXED RESISTOR; Packaging: Bulk; Power: 5W; Technology: WIRE WOUND; Termination: Wire; Construction: Rectangular; Package Style: AXIAL; Working Voltage: 350V; Reach SVHC Compliant: Yes; RoHS Compliant: Yes; ComponentLink1URL: https://www.te.com:443/usa-en/product-3-1623795-2.datasheet.pdf?src-supplier=IHS+Markit; ComponentLink1Description: https://www.te.com:443/usa-en/product-3-1623795-2.datasheet.pdf?src-supplier=IHS+Markit; ComponentLink2URL: http://www.mouser.com/ds/2/418/NG_DS_1773285_M-726265.pdf?src-supplier=Mouser; ComponentLink2Description: http://www.mouser.com/ds/2/418/NG_DS_1773285_M-726265.pdf?src-supplier=Mouser; ComponentLink3URL: https://www.te.com/commerce/DocumentDelivery/DDEController?Action=srchrtrv&amp;DocNm=1773285&amp;DocType=DS&amp;DocLang=English&src-supplier=Digikey; ComponentLink3Description: https://www.te.com/commerce/DocumentDelivery/DDEController?Action=srchrtrv&amp;DocNm=1773285&amp;DocType=DS&amp;DocLang=English&src-supplier=Digikey
R2 R4 = RES_1K OHM_0603: 0.1W, 1000ohm, 75V, 5%, Surface Mount, 0603; Manufacturer: Yageo; Additional Feature: LASER TRIMMABLE; Power: 100mW; Rated Temperature: 70°C; Temperature Coefficient (ppm/Cel): 100; Package Height: 0.45mm; Package Length: 1.6mm; Package Width: 0.8mm; Designed by: Kerem; Supplier: Digikey; Supplier Part Number: 311-1.0KGRCT-ND; Manufacturer Part Number: RC0603JR-071KL; RoHS: Yes; Category: Chip SMD Resistors; Stock: 732542; Pricing: 1=0,1, 10=0,01, 50=0,0082, 100=0,0061, 500=0,0056, 1000=0,0051 (USD); Mounting Technology: Surface Mount; Pins: 2; Package Shape: Rectangular; Case/Package: 0603; Terminal Finish: Nickel; Min Operating Temperature: -55°C; Max Operating Temperature: 155°C; Tolerance: 5%; JESD-609 Code: e3; Resistor Type: FIXED RESISTOR; Construction: Chip; Packaging: Tape and Reel; Technology: METAL GLAZE/THICK FILM; Termination: Wraparound; Working Voltage: 75V; Reach SVHC Compliant: Yes; RoHS Compliant: Yes; ComponentLink1URL: https://datasheet.ciiva.com:443/pdfs/VipMasterIC/IC/YAGO/YAGO-S-A0008145938/YAGO-S-A0008145938-1.pdf?src-supplier=IHS+Markit; ComponentLink1Description: https://datasheet.ciiva.com:443/pdfs/VipMasterIC/IC/YAGO/YAGO-S-A0008145938/YAGO-S-A0008145938-1.pdf?src-supplier=IHS+Markit
R3 R5 = RES 10K OHM 0603: Fixed Resistor, Metal Glaze/thick Film, 0.1W, 10000ohm, 75V, 1% +/-Tol, 100ppm/Cel, Surface Mount, 0603; Manufacturer: Yageo; Additional Feature: LASER TRIMMABLE; Power: 100mW; Rated Temperature: 70°C; Temperature Coefficient (ppm/Cel): 100; Package Height: 0.45mm; Package Length: 1.6mm; Package Width: 0.8mm; Designed by: Kerem; Supplier: Digikey; Supplier Part Number: 311-10.0KHRCT-ND; Manufacturer Part Number: RC0603FR-0710KL; RoHS: Yes; Category: Chip SMD Resistors; Stock: 4804248; Pricing: 1=0,1, 10=0,009, 100=0,0082, 1000=0,00714, 2500=0,00663, 5000=0,00612, 10000=0,00263, 15000=0,00249, 25000=0,00221, 250000=0,00204, 500000=0,0019 (USD); Mounting Technology: Surface Mount; Pins: 2; Package Shape: Rectangular; Case/Package: 0603; Terminal Finish: Nickel; Min Operating Temperature: -55°C; Max Operating Temperature: 155°C; Tolerance: 1%; JESD-609 Code: e3; Resistor Type: FIXED RESISTOR; Construction: Chip; Packaging: Tape and Reel; Technology: METAL GLAZE/THICK FILM; Termination: Wraparound; Working Voltage: 75V; Reach SVHC Compliant: Yes; RoHS Compliant: Yes; ComponentLink1URL: https://datasheet.ciiva.com:443/pdfs/VipMasterIC/IC/YAGO/YAGO-S-A0008145938/YAGO-S-A0008145938-1.pdf?src-supplier=IHS+Markit; ComponentLink1Description: https://datasheet.ciiva.com:443/pdfs/VipMasterIC/IC/YAGO/YAGO-S-A0008145938/YAGO-S-A0008145938-1.pdf?src-supplier=IHS+Markit; ComponentLink2URL: https://datasheet.ciiva.com/46440/1868787-46440891.pdf?src-supplier=Element14; ComponentLink2Description: https://datasheet.ciiva.com/46440/1868787-46440891.pdf?src-supplier=Element14; ComponentLink3URL: https://datasheet.ciiva.com/7746/1738695-7746239.pdf?src-supplier=Element14; ComponentLink3Description: https://datasheet.ciiva.com/7746/1738695-7746239.pdf?src-supplier=Element14; ComponentLink4URL: https://datasheet.ciiva.com/7983/443971-7983596.pdf?src-supplier=Element14; ComponentLink4Description: https://datasheet.ciiva.com/7983/443971-7983596.pdf?src-supplier=Element14; ComponentLink5URL: https://datasheet.ciiva.com/7660/38590-7660789.pdf?src-supplier=Element14; ComponentLink5Description: https://datasheet.ciiva.com/7660/38590-7660789.pdf?src-supplier=Element14; ComponentLink6URL: https://datasheet.ciiva.com/22747/443971-22747519.pdf?src-supplier=Element14; ComponentLink6Description: https://datasheet.ciiva.com/22747/443971-22747519.pdf?src-supplier=Element14; ComponentLink7URL: https://datasheet.ciiva.com/15189/getdatasheetpartid-409289-15189591.pdf?src-supplier=Verical; ComponentLink7Description: https://datasheet.ciiva.com/15189/getdatasheetpartid-409289-15189591.pdf?src-supplier=Verical
RL1 RL2 = ALQ112: Power/Signal Relay, 1 Form C, SPDT, Momentary, 0.033A (Coil), 12VDC (Coil), 400mW (Coil), 5A (Contact), 30VDC (Contact), DC Input, Random, AC/DC Output, Through Hole-Straight Mount; Manufacturer: Panasonic; End Contact Material: Silver; Coil Current(DC)-Max: 33mA; Coil Operate Voltage(DC): 9V; Coil Release Voltage(DC): 600mV; Coil Resistance: 360R; Coil Voltage(DC)-Max: 12V; Contact AC Max Power Rating R Load: 1250VA@250VAC; Contact AC Max Rating R Load: 10A@125VAC; Contact Current(AC)-Max: 10A; Contact DC Max Power Rating R Load: 150W@30VDC; Contact DC Max Rating R Load: 5A@30VDC; Contact Resistance: 100mR; Contact Voltage(AC)-Max: 125V; Contact Voltage(DC)-Max: 30V; Dielectric Strength Between Coil and Contacts: 4000Vrms; Dielectric Strength Between Open Contacts: 750Vrms; Insulation Resistance: 1GR; Operate Time: 20ms; PCB Hole Count: 5; Relay Form: 1 FORM C; Body Breadth: 10mm; Body Height: 16mm; Body Length or Diameter: 20mm; Reference Standard: UL; Sealing: MOISTURE PROOF; Designed by: Kerem; Supplier: Digikey; Supplier Part Number: 255-3562-ND; Manufacturer Part Number: ALQ112; RoHS: Yes; Category: Power Relays; Stock: 9793; Pricing: 1=1,45, 10=1,267, 25=1,2004, 50=1,1528, 100=1,1067, 300=1,03757, 500=1,0069, 1000=0,96674, 5000=0,87955 (USD); Mounting Technology: Through Hole; Pins: 5; Weight: 7g; Min Operating Temperature: -40°C; Max Operating Temperature: 85°C; Coil Power: 400mW; Coil Voltage-Nom: 12V; Coil/Input Supply Type: DC; Contact Current(DC)-Max: 5A; Contact/Output Supply Type: AC/DC; Input Switching Control Type: Random; Packaging: Box; Relay Action: MOMENTARY; Relay Function: SPDT; Relay Type: POWER/SIGNAL RELAY; Release Time: 20ms; Termination: Solder; Terminal Length: 0.0042inch; RoHS Compliant: Yes; ComponentLink1URL: https://datasheet.ciiva.com:443/pdfs/VipMasterIC/IC/PANA/PANA-S-A0003568054/PANA-S-A0003568054-1.pdf?src-supplier=IHS+Markit; ComponentLink1Description: https://datasheet.ciiva.com:443/pdfs/VipMasterIC/IC/PANA/PANA-S-A0003568054/PANA-S-A0003568054-1.pdf?src-supplier=IHS+Markit; ComponentLink2URL: https://datasheet.ciiva.com/24388/307ds-61b20-en-lq-24388909.pdf?src-supplier=Onlinecomponents.com; ComponentLink2Description: https://datasheet.ciiva.com/24388/307ds-61b20-en-lq-24388909.pdf?src-supplier=Onlinecomponents.com
T1 = BV302S12010-ZU: Split Bobbin Power Transformer, 1VA; Manufacturer: Zettler Magnetics; Designed by: Kerem; Voltage - Primary: 230V; Current - Output (Max): 83mA; Voltage - Secondary: 12V; Supplier: Digikey; Supplier Part Number: 3388-BV302S12010-ND; Manufacturer Part Number: BV302S12010; RoHS: No; Category: Uncategorized; Stock: 612; Pricing: 1=3,47, 10=2,553, 25=2,3068, 50=2,1534, 100=2,0233, 250=1,8816, 500=1,79342, 1000=1,71882, 5000=1,58704 (USD); Reach SVHC Compliant: No; RoHS Compliant: No
U1 = LM2675MX-12/NOPB: Switching Regulator, Voltage-mode, 2.2A, 275kHz Switching Freq-Max, DMOS, PDSO8; Manufacturer: TI National Semiconductor; Package Body Material: Plastic; Control Technique: PULSE WIDTH MODULATION; Max Supply Voltage: 40V; Min Input Voltage: 6.5V; Nominal Supply Voltage: 24V; Channels: 1; Nominal Output Voltage: 12V; Switcher Configuration: BUCK; Time @ Peak Reflow Temperature-Max (s): 40s; Qualification Status: Not Qualified; Designed by: Kerem; Supplier: Digikey; Supplier Part Number: 296-35410-1-ND; Manufacturer Part Number: LM2675MX-12/NOPB; RoHS: Yes; Category: Voltage Regulators - Switching; Stock: 2394; Pricing: 1=4,36, 10=3,31, 25=3,046, 100=2,7561, 250=2,61788, 500=2,53454, 1000=2,46595 (USD); Case/Package: SOP; Pins: 8; Package Shape: Rectangular; Terminal Finish: Tin; Min Operating Temperature: -40°C; Max Operating Temperature: 125°C; JESD-609 Code: e3; Throw Configuration: SWITCHING REGULATOR; Control Mode: VOLTAGE-MODE; JESD-30 Code: R-PDSO-G8; Moisture Sensitivity Level: 1; Max Output current: 2.2A; Package Style: SMALL OUTLINEMeter; Peak Reflow Temperature (Cel): 260°C; Surface Mount: Yes; Frequency: 275kHz; Technology: DMOS; Terminal Form: Gull Wing; Terminal Position: DUAL; Length: 4.9mm; Width: 3.9mm; Height - Seated (Max): 1.75mm; Terminal Pitch: 1.27mm; Temperature Grade: AUTOMOTIVE; Reach SVHC Compliant: Yes; RoHS Compliant: Yes; ComponentLink1URL: https://datasheet.ciiva.com:443/pdfs/VipMasterIC/IC/TXII/TXIIS100070/TXIIS168554-1.pdf?src-supplier=IHS+Markit; ComponentLink1Description: https://datasheet.ciiva.com:443/pdfs/VipMasterIC/IC/TXII/TXIIS100070/TXIIS168554-1.pdf?src-supplier=IHS+Markit; ComponentLink2URL: https://datasheet.ciiva.com/41457/001013881-da-01-en-ic-reg-buck-lm2675mx-12-nopb-soic-8-tid-41457896.pdf?src-supplier=Conrad; ComponentLink2Description: https://datasheet.ciiva.com/41457/001013881-da-01-en-ic-reg-buck-lm2675mx-12-nopb-soic-8-tid-41457896.pdf?src-supplier=Conrad; ComponentLink3URL: https://datasheet.ciiva.com/3220/lm2675-3220840.pdf?src-supplier=Avnet; ComponentLink3Description: https://datasheet.ciiva.com/3220/lm2675-3220840.pdf?src-supplier=Avnet
U2 = AP7361-33E-13: Fixed Positive LDO Regulator, 3.3V, 0.7V Dropout, CMOS, PSSO3; Manufacturer: Diodes; Package Body Material: Plastic; Dropout Voltage1-Max: 700mV; Dropout Voltage1-Nom: 500mV; Input Voltage Absolute-Max: 6.5V; Max Supply Voltage: 6V; Min Input Voltage: 4.3V; Channels: 1; Output Current1-Max: 1A; Output Voltage1-Max: 3.399V; Output Voltage1-Min: 3.201V; Regulator Type: FIXED POSITIVE SINGLE OUTPUT LDO REGULATOR; Time @ Peak Reflow Temperature-Max (s): 30s; Voltage Tolerance-Max: 6.5%; Qualification Status: Not Qualified; Designed by: Kerem; Supplier: Digikey; Supplier Part Number: AP7361-33E-13DICT-ND; Manufacturer Part Number: AP7361-33E-13; RoHS: Yes; Category: Voltage Regulators - Linear; Stock: 106877; Pricing: 1=0,71, 10=0,426, 25=0,3508, 100=0,2659, 250=0,22428, 500=0,1986, 1000=0,17711, 2500=0,12316, 5000=0,11176, 7500=0,109 (USD); Pins: 3; Package Shape: Rectangular; Terminal Finish: Tin; JESD-609 Code: e3; Adjustability: FIXED; Moisture Sensitivity Level: 1; Number of Outputs: 1; Operating Temperature, TJ-Max: 150°C; Operating Temperature, TJ-Min: -40°C; Output Voltage1-Nom: 3.3V; Packaging: Tape and Reel; Peak Reflow Temperature (Cel): 260°C; Surface Mount: Yes; Technology: CMOS; Terminal Form: Gull Wing; Terminal Position: SINGLE; Length: 6.5mm; Width: 3.5mm; Height - Seated (Max): 1.8mm; Terminal Pitch: 2.3mm; Reach SVHC Compliant: Yes; RoHS Compliant: Yes; ComponentLink1URL: https://datasheet.ciiva.com:443/pdfs/VipMasterIC/IC/DIOD/DIOD-S-A0002906110/DIOD-S-A0002906110-1.pdf?src-supplier=IHS+Markit; ComponentLink1Description: https://datasheet.ciiva.com:443/pdfs/VipMasterIC/IC/DIOD/DIOD-S-A0002906110/DIOD-S-A0002906110-1.pdf?src-supplier=IHS+Markit; ComponentLink2URL: https://datasheet.ciiva.com/26926/getdatasheetpartid-670786-26926141.pdf?src-supplier=Verical; ComponentLink2Description: https://datasheet.ciiva.com/26926/getdatasheetpartid-670786-26926141.pdf?src-supplier=Verical; ComponentLink3URL: https://datasheet.ciiva.com/25651/ap7361-25651049.pdf?src-supplier=Digikey; ComponentLink3Description: https://datasheet.ciiva.com/25651/ap7361-25651049.pdf?src-supplier=Digikey; Case/Package: SOT-223-3
USB1 = Micro B USB Connector: CONN USB MICRO B RECPT SMT R/A; Manufacturer: Amphenol ICC / FCI; Designed by: Kerem; Supplier: Digikey; Supplier Part Number: 609-4613-1-ND; Manufacturer Part Number: 10118192-0001LF; RoHS: No; Category: Uncategorized; Stock: 17542; Pricing: 1=0,41, 10=0,336, 25=0,31, 50=0,2914, 100=0,274, 250=0,2526, 500=0,23752 (USD)